# Altium schematic sheet TopSheet.SchDoc
size A4; CompanyName: Technische Hochschule Nürnberg Georg Simon Ohm; Organization: UltraZohm; Address1: Kesslerplatz 12; Address2: 90489 Nürnberg; Address3: GERMANY; Website: www.ultrazohm.com
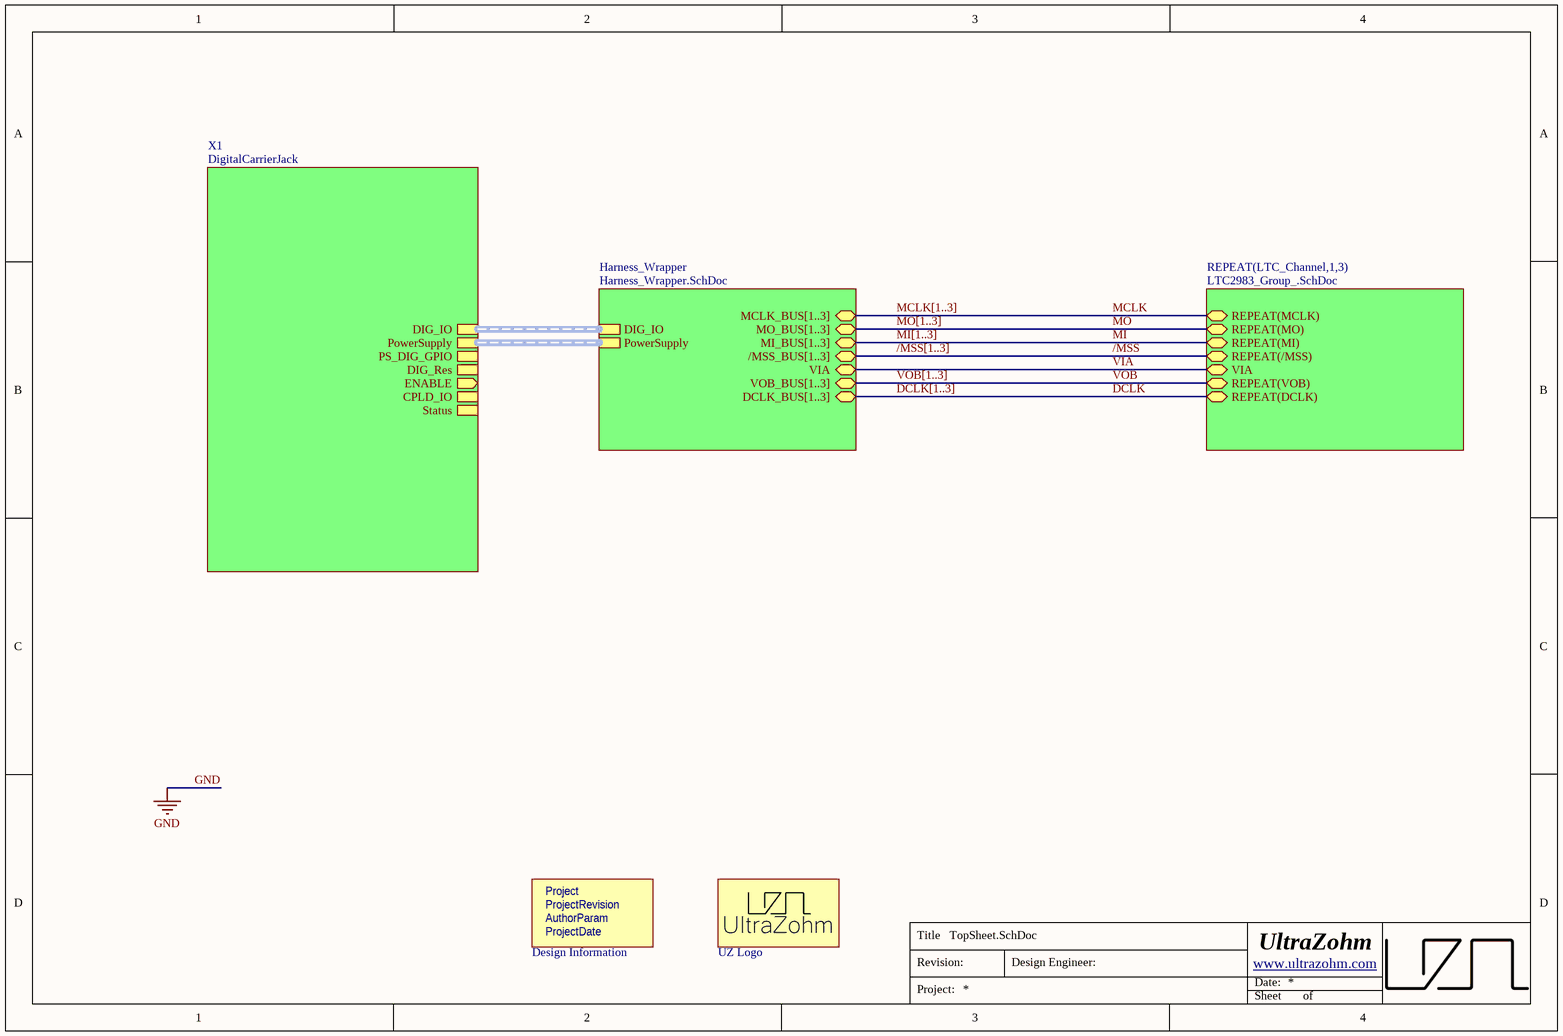
[diagram p0: TopSheet.SchDoc]

## Parts
INFO  Design Information  [Design_info]  (no BOM)
LOGO  UZ Logo  [UZ_Logo_small]  (no BOM)

## Sub-sheets
Harness_Wrapper = Harness_Wrapper.SchDoc: DIG_IO (harness DigCon_DIG_IO), PowerSupply (harness DigCon_PowerSupply), VIA (bidir), MCLK_BUS[1..3] (bidir), MO_BUS[1..3] (bidir), MI_BUS[1..3] (bidir), /MSS_BUS[1..3] (bidir), VOB_BUS[1..3] (bidir), DCLK_BUS[1..3] (bidir)
REPEAT(LTC_Channel,1,3) = LTC2983_Group_.SchDoc: REPEAT(MCLK) (bidir), REPEAT(MO) (bidir), REPEAT(MI) (bidir), REPEAT(/MSS) (bidir), VIA (bidir), REPEAT(VOB) (bidir), REPEAT(DCLK) (bidir)
X1 = DigitalCarrierJack: DIG_IO (harness DigCon_DIG_IO), PowerSupply (harness DigCon_PowerSupply), PS_DIG_GPIO (harness DigCon_PS_DIG_GPIO), DIG_Res (harness DigCon_DIG_Res), ENABLE (out), CPLD_IO (harness DigCon_DCPLD_IO), Status (harness DigCon_Status)

## Nets
/MSS: sheet REPEAT(LTC_Channel,1,3)/REPEAT(/MSS)
DCLK: sheet REPEAT(LTC_Channel,1,3)/REPEAT(DCLK)
MCLK: sheet REPEAT(LTC_Channel,1,3)/REPEAT(MCLK)
MI: sheet REPEAT(LTC_Channel,1,3)/REPEAT(MI)
MO: sheet REPEAT(LTC_Channel,1,3)/REPEAT(MO)
VIA: sheet REPEAT(LTC_Channel,1,3)/VIA, sheet Harness_Wrapper/VIA
VOB: sheet REPEAT(LTC_Channel,1,3)/REPEAT(VOB)

## Buses and harness runs
bus /MSS[1..3] = sheet Harness_Wrapper//MSS_BUS[1..3]
bus DCLK[1..3] = sheet Harness_Wrapper/DCLK_BUS[1..3]
bus MCLK[1..3] = sheet Harness_Wrapper/MCLK_BUS[1..3]
bus MI[1..3] = sheet Harness_Wrapper/MI_BUS[1..3]
bus MO[1..3] = sheet Harness_Wrapper/MO_BUS[1..3]
bus VOB[1..3] = sheet Harness_Wrapper/VOB_BUS[1..3]
harness sheet Harness_Wrapper/DIG_IO = sheet X1/DIG_IO
harness sheet Harness_Wrapper/PowerSupply = sheet X1/PowerSupply

## Notes on the sheet
- Title
- Revision:
- Design Engineer:
- Date:
- Project:
- Sheet
- of
- (in symbol Design Information) Project; ProjectRevision; AuthorParam; ProjectDate

## Library data of the parts
INFO = Design Information: Manufacturer: UltraZohm; Created from: MGremer; Manufacturer Part Number: Design Information; PartID: 12; Created On: 03.11.2021 09:04:23; ComponentLink1Description: https://docs.ultrazohm.com/; ComponentLink1URL: homepage; Component Type: Design Information; Last Updated: 03.11.2021 09:28:34; Supplier 1: -; Supplier Part Number 1: -; Type: Design Information; Value: Design Information; Live Cycle Status: 1
LOGO = Logo small: Manufacturer: UltraZohm; Created from: MGremer; Created: Jan2021_Liegmann; Value: Logo; Manufacturer Part Number: Logo small; PartID: 10; Created On: 03.11.2021 09:04:23; ComponentLink1Description: https://docs.ultrazohm.com/; ComponentLink1URL: homepage; Component Type: Logo; Last Updated: 03.11.2021 09:05:50; Supplier 1: -; Supplier Part Number 1: -; Type: Logo; Live Cycle Status: 1